# EAGLE design Boost (EAGLE 7.7.0)
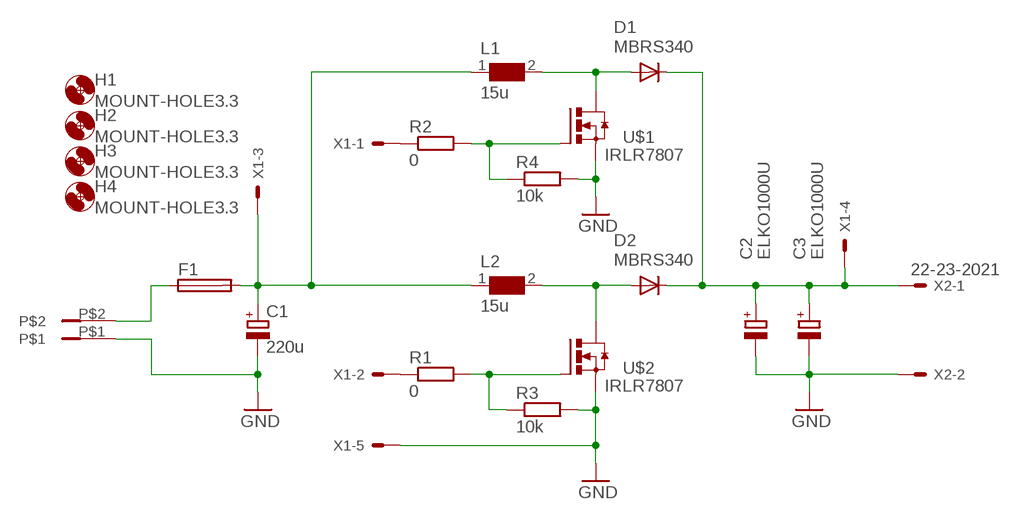
[diagram p0: schematic, sheet 1]

## Parts
C1  220u  CPOL-EUF  [PANASONIC_F]
C2  ELKO1000U  [J16]
C3  ELKO1000U  [J16]
D1  MBRS340  DIODE-SMC  [SMC]
D2  MBRS340  DIODE-SMC  [SMC]
F1  SH22,5  [SH22,5]
H1  MOUNT-HOLE3.3  [3,3]
H2  MOUNT-HOLE3.3  [3,3]
H3  MOUNT-HOLE3.3  [3,3]
H4  MOUNT-HOLE3.3  [3,3]
L1  15u  DROSSEL-WE-PD-7447709150_1260/1245/1280/1210  [WE-PD_1260/1245/1280/1210]
L2  15u  DROSSEL-WE-PD-7447709150_1260/1245/1280/1210  [WE-PD_1260/1245/1280/1210]
R1  0  R-EU_MELF0204W  [MINI_MELF-0204W]
R2  0  R-EU_MELF0204W  [MINI_MELF-0204W]
R3  10k  R-EU_MELF0204W  [MINI_MELF-0204W]
R4  10k  R-EU_MELF0204W  [MINI_MELF-0204W]
U$1  IRLR7807  [D-PAK]
U$2  IRLR7807  [D-PAK]
U$3  RIACON-2  [RIACON2]
X1  22-23-2051  [22-23-2051]
X2  22-23-2021  [22-23-2021]

## Nets
GND: C1.- C2.- C3.- R3.2 R4.2 U$1.3(S) U$2.3(S) U$3.P$1 X1.5 X2.2
N$5: F1.1 U$3.P$2
N$6: R2.2 R4.1 U$1.1(G)
N$7: R1.1 X1.2
N$8: R2.1 X1.1
N$9: R1.2 R3.1 U$2.1(G)
SW1: D1.A L1.2 U$1.4(D)
SW2: D2.A L2.2 U$2.4(D)
UIN: C1.+ F1.2 L1.1 L2.1 X1.3
UOUT: C2.+ C3.+ D1.C D2.C X1.4 X2.1

## Library data of the parts
C1 = rcl:CPOL-EU: POLARIZED CAPACITOR, European symbol
C2 C3 = ppst002:ELKO1000U: Elektrolytkondensator 1000µF
D1 D2 = diode:DIODE-: DIODE
F1 = fuse:SH22,5: FUSE HOLDER grid 22,5 mm, OGN0031 8201, Schurter (Buerklin); MF: SCHURTER; MPN: 0031.8201; OC_FARNELL: 1162740; OC_NEWARK: 96F8317
H1-H4 = holes:MOUNT-HOLE: MOUNTING HOLE with drill center marker
L1 L2 = ppst002:DROSSEL-WE-PD: SMD-Shielded Power Inductors WE-PD - Magnetically shielded version which results in a low leakage field - High storage capacity - Low self-losses - Highest possible current loading for SMD-Inducors -- Switching regulators with low operating voltages (computer, laptop, mobile phones, pagers) -- Integrated DC/DC-converter -- Is recommended for the application with switching regulators from National Semiconductor, Linear Technology, Texas Instruments and Fairchild Semiconductor, ect. -- Graphic cards -- Plastic base: Because of the one piece construction these are more suitable for high vibration or shock applications; MPN: 7447709150; OC_FARNELL: 1635944; OC_NEWARK: 08P2772; PACKAGE: 1210; SUPPLIER: Wuerth Elektronik
R1-R4 = resistor:R-EU_: RESISTOR, European symbol
U$1 U$2 = ppst002:IRLR7807: Power MOSFET
U$3 = ppst002:RIACON-2: Anreihklemme 2 polig, RM 5mm
X1 = con-molex:22-23-2051: .100" (2.54mm) Center Header - 5 Pin; MF: MOLEX; MPN: 22-23-2051; OC_FARNELL: 1462952; OC_NEWARK: 38C9178
X2 = con-molex:22-23-2021: .100" (2.54mm) Center Header - 2 Pin; MF: MOLEX; MPN: 22-23-2021; OC_FARNELL: 1462926; OC_NEWARK: 25C3832

## Board
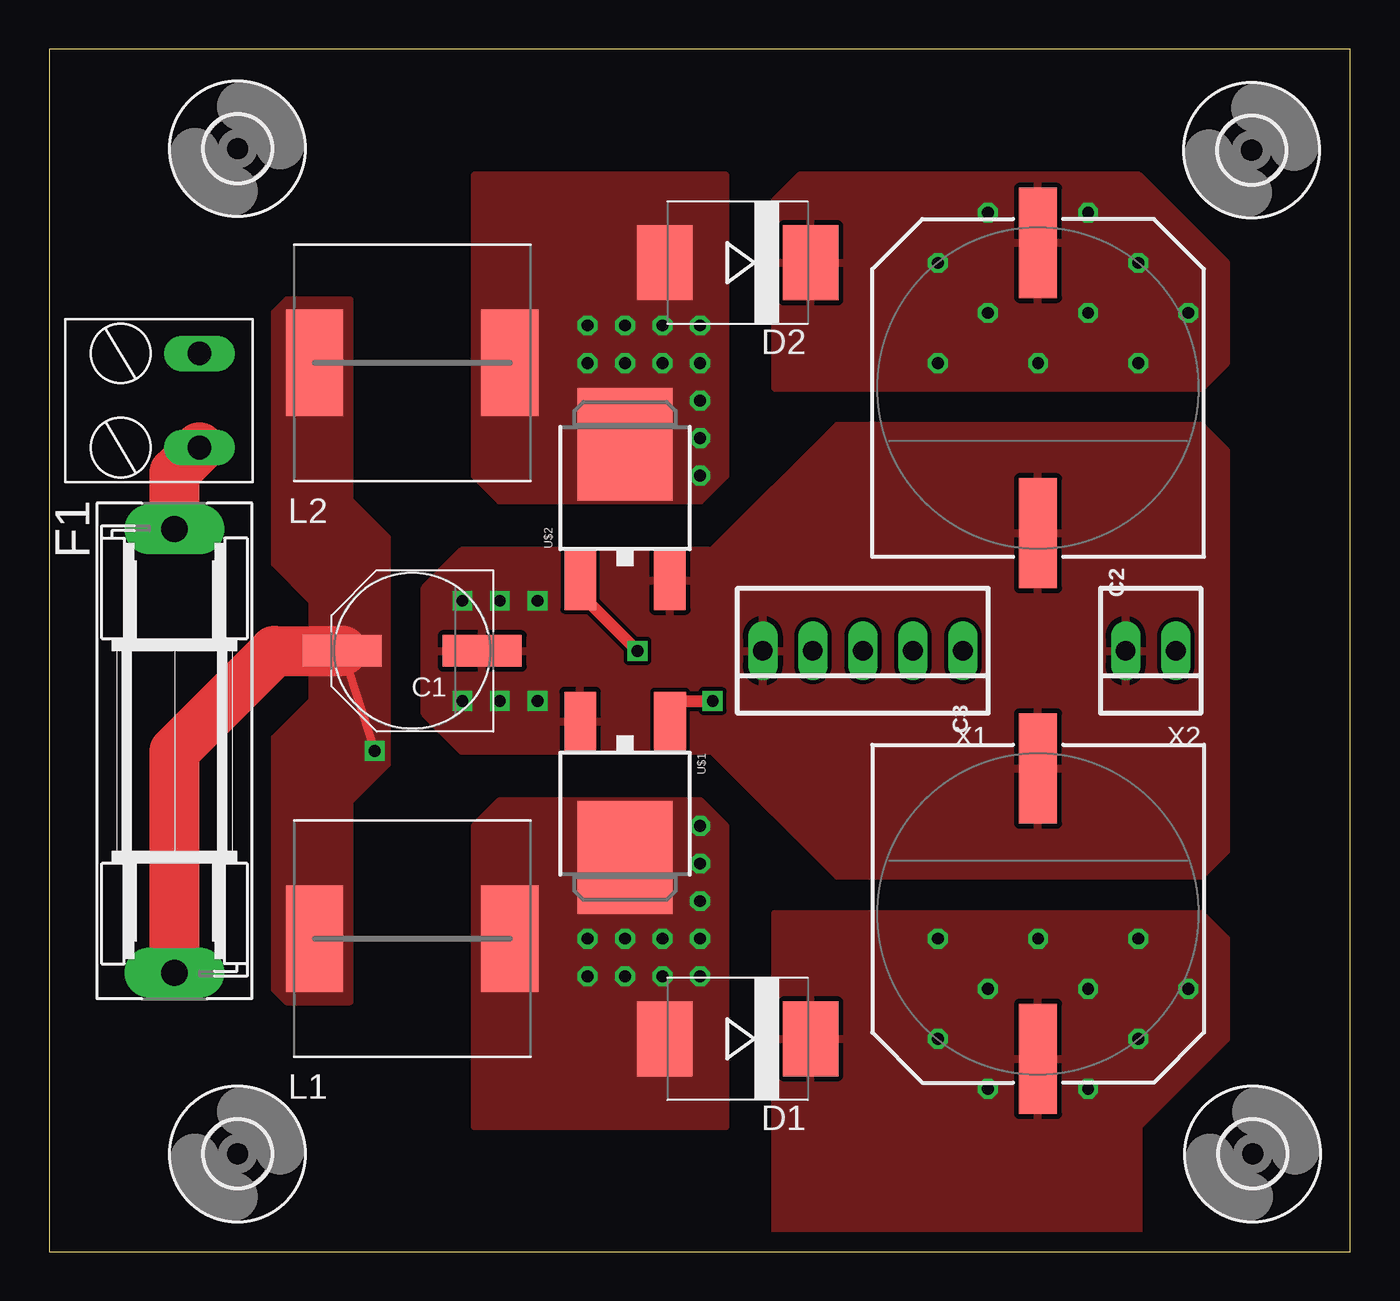
[diagram p1: board, top side]
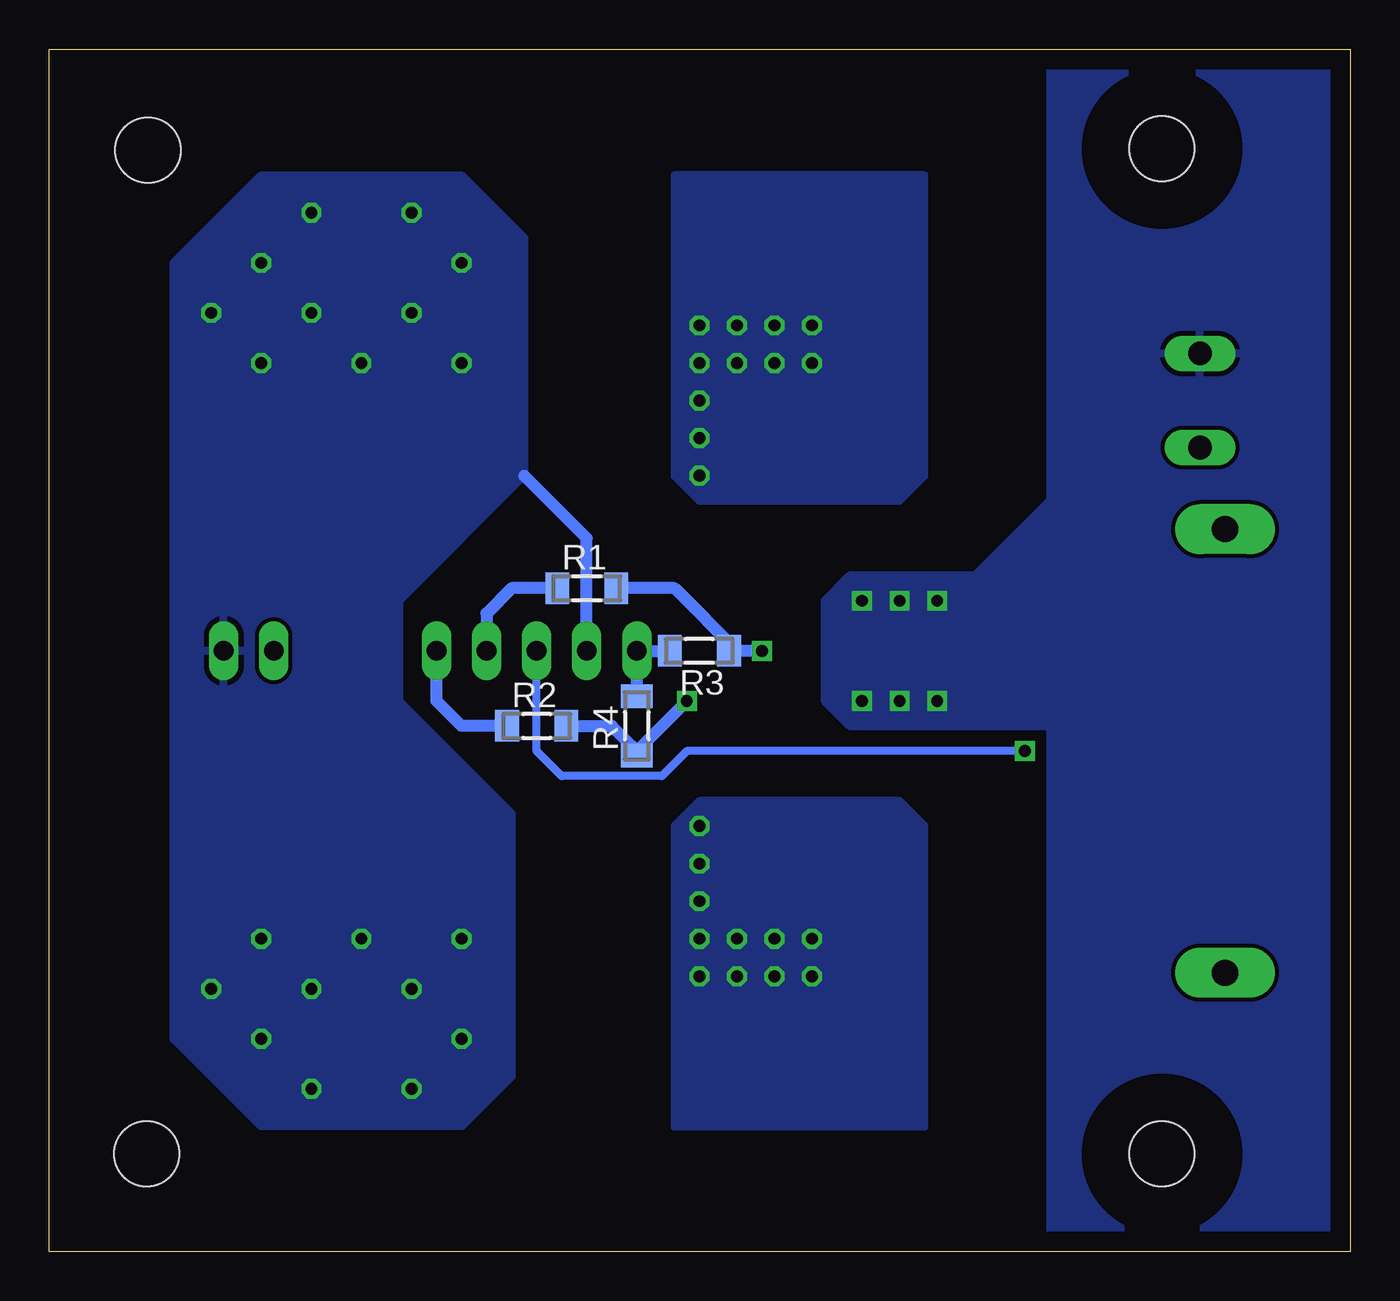
[diagram p2: board, bottom side, seen from below]

Size 66 x 61 mm. Coordinates in mm from the lower left corner, seen from the top.
Outline: 0,0 66,0 66,61 0,61 0,0
Copper layers (1*16): Top 0.035mm / dielectric 1.5mm / Bottom 0.035mm
Design rules "default *": minimum track width 10mil, minimum drill 20mil, track to track 8mil, track to pad 8mil, pad to pad 8mil, via to via 8mil, smd to smd 8mil, copper to edge 40mil, drill to drill 8mil, minimum pad ring 10mil, minimum via ring 8mil, stop-mask expansion 4mil, vias tented up to drill 0mil, thermal gap 10mil

### Footprints (pad centres in the part's own frame; a part is rotated, then mirrored left to right if it is on the bottom)
PANASONIC_F = smd 4 x 1.6: + 3.55,0; - -3.55,0
J16 = smd 5.588 x 1.93: + -8.636,0; - 6.096,0
SMC = smd 2.8 x 3.8: A 3.7,0; C -3.7,0
SH22,5 = drill 1.321 pad 2.54 long: 1 -11.252,0; 2 11.252,0
3,3 = hole 3.3: 0,0
WE-PD_1260/1245/1280/1210 = smd 2.9 x 5.4: 1 -4.95,0; 2 4.95,0
MINI_MELF-0204W = smd 1.2 x 1.6: 1 -1.5,0; 2 1.5,0
D-PAK = smd 1.6 x 3: 1 1.53,2.31; 3 6.09,2.31 | smd 4.826 x 5.715: 4 3.81,9.208
RIACON2 = drill 1.2 long: P$1 6.35,6.83; P$2 6.35,2.06
22-23-2051 = drill 1 long: 1 -5.08,0; 2 -2.54,0; 3 0,0; 4 2.54,0; 5 5.08,0
22-23-2021 = drill 1 long: 1 -1.27,0; 2 1.27,0

### Placement (x,y rotation side)
C1  18.41,30.48 180 top
C2  50.16,42.55 270 top
C3  50.16,18.41 90 top
D1  34.92,10.79 180 top
D2  34.92,50.16 180 top
F1  6.35,25.4 270 top
H1  61.05,4.96 0 top
H2  60.99,55.88 0 top
H3  9.55,55.95 0 top
H4  9.55,4.96 0 top
L1  18.41,15.88 0 top
L2  18.41,45.09 0 top
R1  38.73,33.66 0 bottom
R2  41.27,26.67 0 bottom
R3  33.02,30.48 180 bottom
R4  36.2,26.67 90 bottom
U$1  33.02,29.21 180 top
U$2  25.4,31.75 0 top
U$3  1.27,38.73 0 top
X1  41.27,30.48 180 top
X2  55.88,30.48 180 top

### Tracks (layer width: path | path; a pad name or v marks a point on that pad's centre or on a via)
GND  (via drill 0.6)
  Bottom 0.61: R4.2 X1.5 R3.2
  other vias: 20.95,33.02 22.86,33.02 24.77,33.02 20.95,27.94 22.86,27.94 24.77,27.94
  pour Top: 19.05,27.3 19.05,33.66 20.95,35.56 33.66,35.56 40.01,41.91 58.42,41.91 59.69,40.64 59.69,20.32 58.42,19.05 40.01,19.05 33.66,25.4 20.95,25.4
  pour Bottom: 25.4,26.67 15.24,26.67 15.24,0 0,0 0,60.96 15.24,60.96 15.24,38.1 19.05,34.29 25.4,34.29 26.67,33.02 26.67,27.94
N$5
  Top 2.54: F1.1 6.35,39.52 U$3.P$2
N$6  (via drill 0.6)
  Top 0.61: U$1.1 31.34,27.71 31.75,27.94 v33.66,27.94
  Bottom 0.61: v33.66,27.94 36.2,25.4 35.97,25.4 R4.1 36.42,25.4 36.42,25.63 37.47,26.67 R2.2
N$7
  Bottom 0.61: R1.1 42.55,33.66 43.81,32.38 X1.2
N$8
  Bottom 0.61: R2.1 45.09,26.67 46.35,27.94 X1.1
N$9  (via drill 0.6)
  Top 0.61: U$2.1 26.93,33.4 v29.84,30.48
  Bottom 0.61: R1.2 34.29,33.66 31.11,30.48 | v29.84,30.48 31.11,30.48 | 31.11,30.48 R3.1
SW1  (via drill 0.6)
  other vias: 27.3,15.88 29.21,15.88 31.11,15.88 27.3,13.97 29.21,13.97 31.11,13.97 33.02,13.97 33.02,15.88 33.02,17.78 33.02,19.68 33.02,21.59
  pour Top (no thermals): 21.59,6.35 21.59,21.59 22.86,22.86 33.02,22.86 34.29,21.59 34.29,6.35
  pour Bottom: 21.59,6.35 21.59,21.59 22.86,22.86 33.02,22.86 34.29,21.59 34.29,6.35
SW2  (via drill 0.6)
  other vias: 27.3,45.09 29.21,45.09 31.11,45.09 31.11,46.99 29.21,46.99 27.3,46.99 33.02,46.99 33.02,45.09 33.02,43.18 33.02,41.27 33.02,39.37
  pour Top (no thermals): 21.59,39.37 21.59,54.61 34.29,54.61 34.29,39.37 33.02,38.1 22.86,38.1
  pour Bottom: 21.59,54.61 34.29,54.61 34.29,39.37 33.02,38.1 22.86,38.1 21.59,39.37
UIN  (via drill 0.6)
  Top 0.406: C1.+ v16.51,25.4
  Top 2.54: F1.2 6.35,25.4 11.43,30.48 C1.+
  Bottom 0.406: v16.51,25.4 33.66,25.4 34.92,24.13 40.01,24.13 41.27,25.4 X1.3
  pour Top (no thermals): 15.24,12.7 15.24,22.86 17.14,24.77 17.14,36.2 15.24,38.1 15.24,48.26 12.06,48.26 11.43,47.62 11.43,34.92 13.34,33.02 13.34,27.94 11.43,26.04 11.43,13.34 12.06,12.7
UOUT  (via drill 0.6)
  Bottom 0.61: X1.4 38.73,36.2 41.91,39.37
  other vias: 45.09,15.88 47.62,13.34 50.16,15.88 55.24,15.88 45.09,10.79 47.62,8.26 57.78,13.34 52.7,13.34 55.24,10.79 52.7,8.26 52.7,52.7 55.24,45.09 55.24,50.16 45.09,50.16 47.62,52.7 57.78,47.62 50.16,45.09 47.62,47.62 52.7,47.62 45.09,45.09
  pour Top: 36.83,43.81 36.83,53.34 38.1,54.61 55.24,54.61 59.69,50.16 59.69,45.09 58.42,43.81
  pour Top: 36.83,17.14 58.42,17.14 59.69,15.88 59.69,10.79 55.24,6.35 55.24,0 36.83,0
  pour Bottom: 55.24,6.35 59.69,10.79 59.69,50.16 55.24,54.61 45.09,54.61 41.91,51.44 41.91,39.37 48.26,33.02 48.26,27.94 42.55,22.23 42.55,8.89 45.09,6.35